# Altium schematic sheet spi_flash.SchDoc
size A
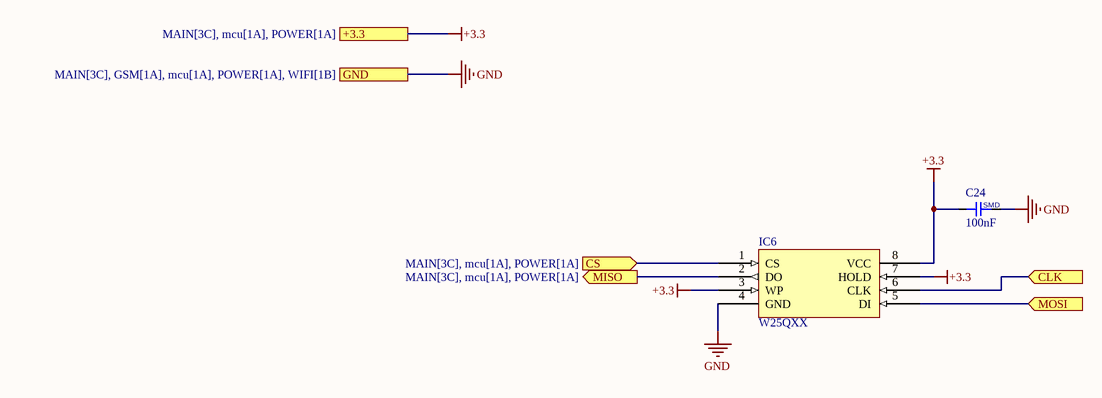
[diagram p0: spi_flash.SchDoc]

## Parts
C24  100nF  [CAP-0603]
IC6  W25QXX  [SOIC-8PIN-280MIL]

## Ports
+3.3 (see MAIN[3C], mcu[1A], POWER[1A]), CLK (in), CS (in, see MAIN[3C], mcu[1A], POWER[1A]), GND (see MAIN[3C], GSM[1A], mcu[1A], POWER[1A], WIFI[1B]), MISO (out, see MAIN[3C], mcu[1A], POWER[1A]), MOSI (in)

## Nets
+3.3: C24.1 IC6.3(WP) IC6.7(HOLD) IC6.8(VCC) ; port +3.3
GND: C24.2 IC6.4(GND) ; port GND
CLK: IC6.6(CLK) ; port CLK
CS: IC6.1(CS) ; port CS
MISO: IC6.2(DO) ; port MISO
MOSI: IC6.5(DI) ; port MOSI

## Notes on the sheet
- (in symbol cap_smd) SMD

## Library data of the parts
C24 = cap_smd